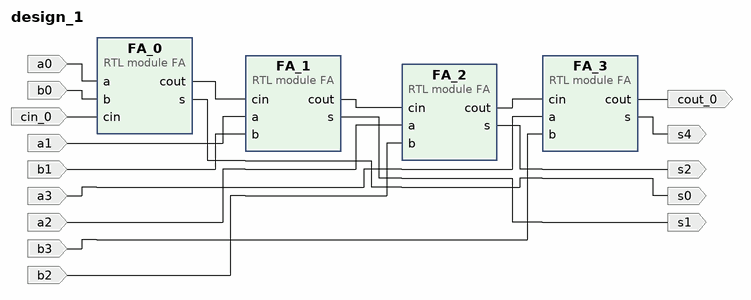
[diagram p0: block diagram of the top level]
# Vivado block design design_1, xc7a35tcpg236-1, Vivado 2025.1
create_bd_design design_1

create_bd_port -dir O s4
create_bd_port -dir I a3
create_bd_port -dir I b3
create_bd_port -dir O cout_0
create_bd_port -dir I a2
create_bd_port -dir I b2
create_bd_port -dir O s2
create_bd_port -dir I cin_0
create_bd_port -dir O s0
create_bd_port -dir O s1
create_bd_port -dir I b1
create_bd_port -dir I a1
create_bd_port -dir I a0
create_bd_port -dir I b0

create_bd_cell -type module -reference FA FA_0
create_bd_cell -type module -reference FA FA_1
create_bd_cell -type module -reference FA FA_2
create_bd_cell -type module -reference FA FA_3

# ---- connections ----

connect_bd_net [get_bd_pins FA_0/cout] [get_bd_pins FA_1/cin]
connect_bd_net [get_bd_pins FA_0/s] [get_bd_ports s0]
connect_bd_net [get_bd_pins FA_1/cout] [get_bd_pins FA_2/cin]
connect_bd_net [get_bd_pins FA_1/s] [get_bd_ports s1]
connect_bd_net [get_bd_pins FA_2/cout] [get_bd_pins FA_3/cin]
connect_bd_net [get_bd_pins FA_2/s] [get_bd_ports s2]
connect_bd_net [get_bd_pins FA_3/cout] [get_bd_ports cout_0]
connect_bd_net [get_bd_pins FA_3/s] [get_bd_ports s4]
connect_bd_net -net a_0_1 [get_bd_ports a3] [get_bd_pins FA_3/a]
connect_bd_net -net a_0_2 [get_bd_ports a1] [get_bd_pins FA_1/a]
connect_bd_net -net a_0_3 [get_bd_ports a0] [get_bd_pins FA_0/a]
connect_bd_net -net a_1_1 [get_bd_ports a2] [get_bd_pins FA_2/a]
connect_bd_net -net b_0_1 [get_bd_ports b3] [get_bd_pins FA_3/b]
connect_bd_net -net b_0_2 [get_bd_ports b1] [get_bd_pins FA_1/b]
connect_bd_net -net b_0_3 [get_bd_ports b0] [get_bd_pins FA_0/b]
connect_bd_net -net b_1_1 [get_bd_ports b2] [get_bd_pins FA_2/b]
connect_bd_net -net cin_0_1 [get_bd_ports cin_0] [get_bd_pins FA_0/cin]

validate_bd_design
save_bd_design
